# Altium schematic sheet Raspberry_HAT.SchDoc
size A4; SheetNumber: 1; SheetTotal: 1
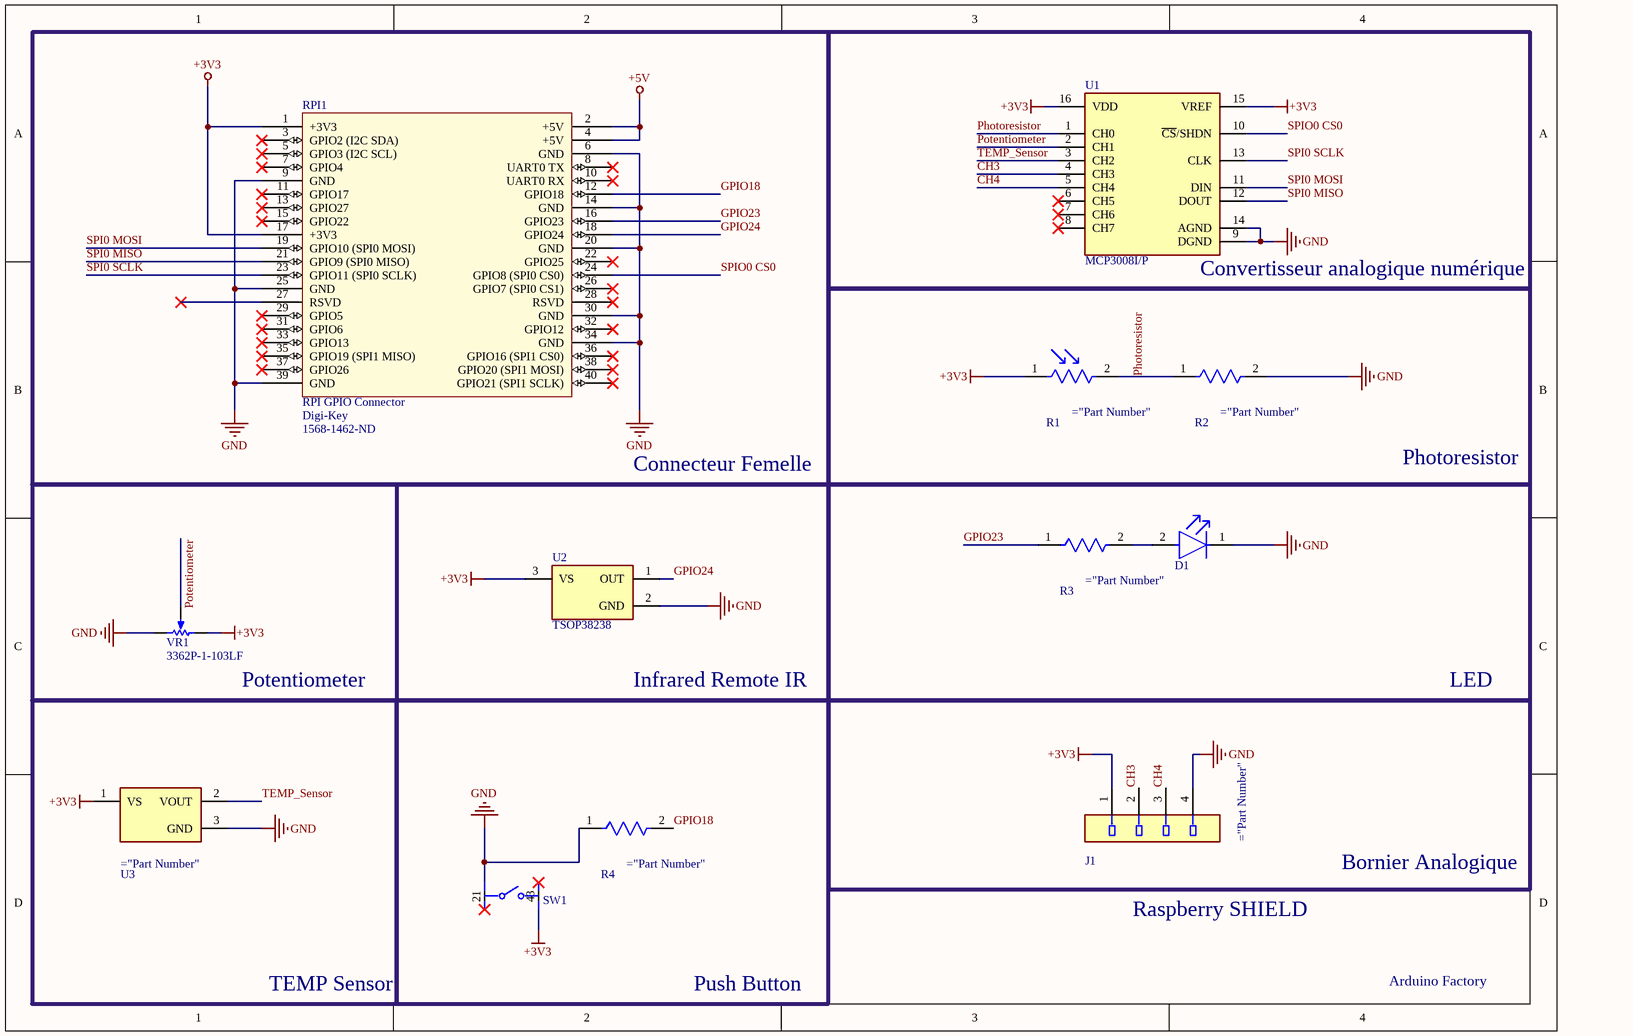
[diagram p0: Raspberry_HAT.SchDoc]

## Parts
D1  Diode_Vishay_TLDR4900_eec  [Vishay_TLDR4900_0]  (value not drawn)
J1  61300411121  [Wurth_61300511121_0]  (value not drawn)
R1  PDV-P9002  [Advanced_Photonix_PDV-P9002_0]  (value not drawn)
R2  CF14JT10K0  [Stackpole_Electronics_Inc._CF14JT1K00_0]  (value not drawn)
R3  CF14JT10K0  [Stackpole_Electronics_Inc._CF14JT1K00_0]  (value not drawn)
R4  CF14JT10K0  [Stackpole_Electronics_Inc._CF14JT1K00_0]  (value not drawn)
RPI1  RPI GPIO Connector  Supplier 1: Digi-Key  Supplier Part Number 1: 1568-1462-ND  [rpi]
SW1  Switch_TE_FSM4JH_eec  [TE_FSM4JH_0]  (value not drawn)
U1  Part Number: MCP3008I/P  [Microchip_MCP3008I-P_0]  (hidden comment: IC_Microchip_MCP3008I-P_eec)
U2  Part Number: TSOP38238  [Vishay_TSOP38238_0]  (hidden comment: IC_Vishay_TSOP38238_eec)
U3  TMP36GT9Z  [Vishay_TSOP38238_0]  (value not drawn)
VR1  3362P-1-103LF  [BOUR-3362P]

## Blocks framed on the sheet
Connecteur Femelle: RPI1
Convertisseur analogique numérique: U1

## Nets
+3V3: J1.1 R1.1 RPI1.1(+3V3) RPI1.17(+3V3) SW1.4 U1.15(VREF) U1.16(VDD) U2.3(VS) U3.1(VS) VR1.1(CCW)
+5V: RPI1.2(+5V) RPI1.4(+5V)
GND: D1.1(C) J1.4 R2.2 R4.1 RPI1.6(GND) RPI1.9(GND) RPI1.14(GND) RPI1.20(GND) RPI1.25(GND) RPI1.30(GND) RPI1.34(GND) RPI1.39(GND) SW1.1 U1.9(DGND) U1.14(AGND) U2.2(GND) U3.3(GND) VR1.3(CW)
CH3: J1.2 U1.4(CH3)
CH4: J1.3 U1.5(CH4)
GPIO18: R4.2 RPI1.12(GPIO18)
GPIO23: R3.1 RPI1.16(GPIO23)
GPIO24: RPI1.18(GPIO24) U2.1(OUT)
Photoresistor: R1.2 R2.1 U1.1(CH0)
Potentiometer: U1.2(CH1) VR1.2(S)
SPI0 MISO: RPI1.21(GPIO9_(SPI0_MISO)) U1.12(DOUT)
SPI0 MOSI: RPI1.19(GPIO10_(SPI0_MOSI)) U1.11(DIN)
SPI0 SCLK: RPI1.23(GPIO11_(SPI0_SCLK)) U1.13(CLK)
SPIO0 CS0: RPI1.24(GPIO8_(SPI0_CS0)) U1.10(~{CS}/SHDN)
TEMP_Sensor: U1.3(CH2) U3.2(VOUT)
NetD1_2: D1.2(A) R3.2

Not connected (* = marked no-connect by the designer): RPI1 3(GPIO2_(I2C_SDA))* 5(GPIO3_(I2C_SCL))* 7(GPIO4)* 8(UART0_TX)* 10(UART0_RX)* 11(GPIO17)* 13(GPIO27)* 15(GPIO22)* 22(GPIO25)* 26(GPIO7_(SPI0_CS1))* 27(RSVD)* 28(RSVD)* 29(GPIO5)* 31(GPIO6)* 32(GPIO12)* 33(GPIO13)* 35(GPIO19_(SPI1_MISO))* 36(GPIO16_(SPI1_CS0))* 37(GPIO26)* 38(GPIO20_(SPI1_MOSI))* 40(GPIO21_(SPI1_SCLK))*; SW1 2* 3*; U1 6(CH5)* 7(CH6)* 8(CH7)*

## Notes on the sheet
- Photoresistor
- Potentiometer
- Infrared Remote IR
- LED
- Raspberry SHIELD
- Bornier Analogique
- Arduino Factory
- TEMP Sensor
- Push Button

## Library data of the parts
D1 = Diode_Vishay_TLDR4900_eec: DIODE Red 648nm LED Indication - Discrete 1.8V Radial; Manufacturer: Vishay; Part Number: TLDR4900; helpURL: https://upverter.com/upn/revision/3413b80474b1e1cb/; ComponentLink2Description: Datasheet; Temperature: -40°C to +100°C; Package: RADIAL; Supplier 2: Mouser; Price: 0.284696517124; Supplier 1: Digi-Key; ComponentLink1URL: https://upverter.com/upn/revision/3413b80474b1e1cb/; Supplier Part Number 2: 78-TLDR4900; Supplier Part Number 1: 751-1089-ND; ComponentLink1Description: Upverter; ComponentLink2URL: https://upverter.com/datasheet/eb3511e92b833138717dd1aad2a9f7f88fefa88c.pdf; RoHS: TRUE; Mouser Part Number: 78-TLDR4900; Ipc Land Pattern Name: DIORD254W85D320H610; Temperature Range High: +100°C; Digikey Description: DIODE Red 648nm LED Indication - Discrete 1.8V Radial; Digikey Part Number: 751-1089-ND; Lead Free: yes; Temperature Range Low: -40°C
RPI1 = rpi connector: GPIO Header for Raspberry Pi A+/B+/Pi 2/Pi 3 - 2x20; Manufacturer: SparkFun Electronics; Manufacturer Part Number: PRT-14017; Nils Minor: author; nilsminor@web.de: mail; RoHS: RoHS Compliant; Category: Development Boards, Kits, Programmers; Stock 1: 150; Pricing 1: 1=1.84 (EUR); Part Status: Active; Accessory Type: Connector; For Use With/Related Products: Raspberry Pi; ComponentLink1URL: https://cdn.sparkfun.com/datasheets/Dev/RaspberryPi/12313.pdf; ComponentLink1Description: https://cdn.sparkfun.com/datasheets/Dev/RaspberryPi/12313.pdf
SW1 = Switch_TE_FSM4JH_eec: SWITCH TACTILE SPST-NO 0.05A 24V; Part Number: FSM4JH; Manufacturer: TE; Voltage: 12; helpURL: https://upverter.com/upn/revision/266e2d494f5bd45c/; ComponentLink2Description: Datasheet; Temperature: -35°C to +85°C; Package: SW_PTH_SPST; Supplier 2: Mouser; Supplier 1: Digi-Key; ComponentLink1URL: https://upverter.com/upn/revision/266e2d494f5bd45c/; Supplier Part Number 2: 506-FSM4JH; Supplier Part Number 1: 450-1650-ND; ComponentLink1Description: Upverter; ComponentLink2URL: http://www.te.com/commerce/DocumentDelivery/DDEController?Action=srchrtrv&DocNm=1825910&DocType=Customer+Drawing&DocLang=English; RoHS: TRUE; Mouser Part Number: 506-FSM4JH; Temperature Range High: +85°C; Digikey Description: SWITCH TACTILE SPST-NO 0.05A 24V; Digikey Part Number: 450-1650-ND; Lead Free: yes; Temperature Range Low: -35°C
U1 = IC_Microchip_MCP3008I-P_eec: IC ADC 10BIT 2.7V 8CH SPI 16DIP; Input Type: Pseudo-Differential, Single Ended; Sampling Rate (Per Second): 200k; Configuration: MUX-S/H-ADC; helpURL: https://upverter.com/upn/revision/d4fed12505406db9/; ComponentLink2Description: Datasheet; Temperature: -40°C to +85°C; Package: PDIP16; Supplier 2: Mouser; Supplier 1: Digi-Key; ComponentLink1URL: https://upverter.com/upn/revision/d4fed12505406db9/; Supplier Part Number 2: 579-MCP3008-I/P; Supplier Part Number 1: MCP3008-I/P-ND; Manufacturer: Microchip; ComponentLink1Description: Upverter; ComponentLink2URL: http://ww1.microchip.com/downloads/en/DeviceDoc/21295d.pdf; RoHS: TRUE; Mouser Part Number: 579-MCP3008-I/P; Ipc Land Pattern Name: DIP787W46P254L1918H533Q16; Temperature Range High: +85°C; Digikey Description: IC ADC 10BIT 2.7V 8CH SPI 16DIP; Digikey Part Number: MCP3008-I/P-ND; Lead Free: yes; Temperature Range Low: -40°C
U2 = IC_Vishay_TSOP38238_eec: IC IR RCVR MOD 38KHZ DOME RADIAL; Manufacturer: Vishay; helpURL: https://upverter.com/upn/revision/415f0ba2412af72c/; ComponentLink2Description: Datasheet; Temperature: -25°C to +85°C; Package: PTH_5MM0_4MM8; Supplier 2: Mouser; Price: 0.634955148256; Supplier 1: Digi-Key; ComponentLink1URL: https://upverter.com/upn/revision/415f0ba2412af72c/; Supplier Part Number 2: 782-TSOP38238; Supplier Part Number 1: 751-1227-ND; ComponentLink1Description: Upverter; ComponentLink2URL: http://www.vishay.com/docs/82491/tsop382.pdf; RoHS: TRUE; Mouser Part Number: 782-TSOP38238; Temperature Range High: +85°C; Digikey Description: IC IR RCVR MOD 38KHZ DOME RADIAL; Digikey Part Number: 751-1227-ND; Lead Free: yes; Temperature Range Low: -25°C
VR1 = 3362P-1-103LF: Square Trimpot(R) Trimming Potentiometer, 10 KOhm, 300 V, -55 to 125 degC, 3-Pin THD, RoHS, Tube; Tolerance: 1%; Voltage Rating: 220 mV; Resistance: 50 mohm; Power Rating: 1 W; RoHSCompliant: True; Case/Package: 1206; Min Operating Temperature: -25degC; Case Code (Imperial): 0612; Width: 1.6 mm; Max Operating Temperature: 125degC; ComponentLink1Description: Manufacturer URL; ComponentLink2Description: Datasheet; DatasheetVersion: May-16; ComponentLink1URL: http://www.bourns.com/; ComponentLink2URL: http://www.bourns.com/docs/Product-Datasheets/3362.pdf; PackageReference: 3326P; Pins: 2; Mount: Surface Mount; Length: 3.2 mm; REACH SVHC: No SVHC; Package Quantity: 5000; Height: 0.6 mm; Packaging: Tape and Reel; PackageDescription: 3-Pin Through Hole Device, Body 6.6 x 6.99 mm, Pitch 2.54 mm; Case Code (Metric): 1632; PartNumber: 3362P-1-103LF